# Altium schematic sheet SOIL_MOISTURE_3IN.SchDoc
size A3
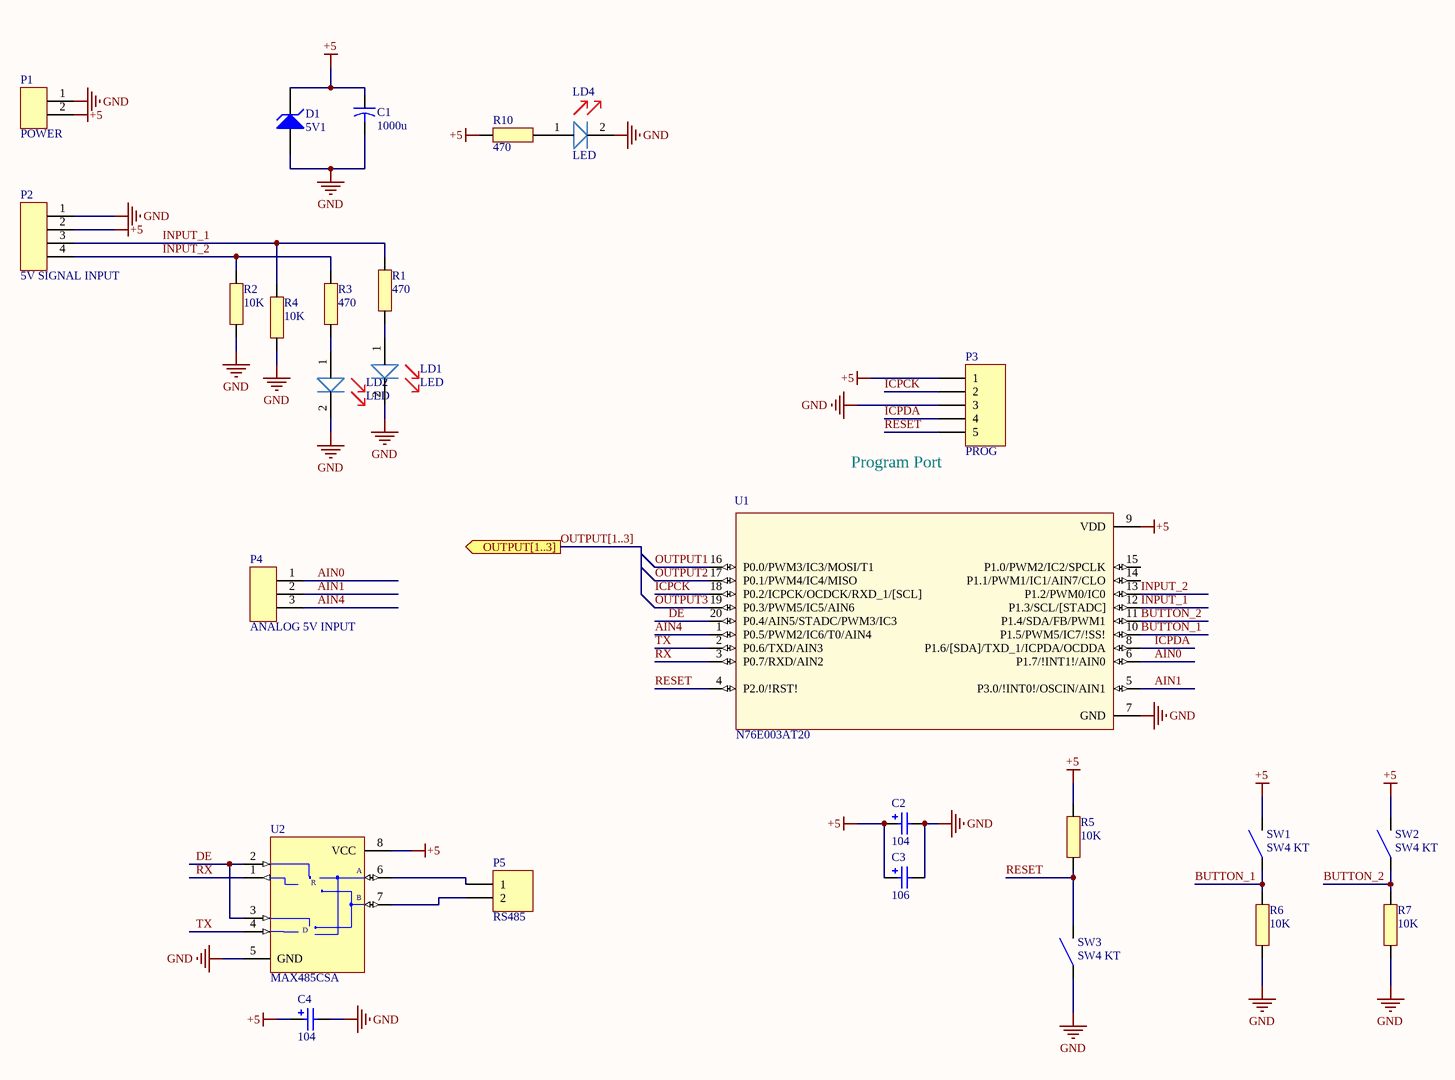
[diagram p0: SOIL_MOISTURE_3IN.SchDoc]

## Parts
C1  1000u  [CAPR5-4X5]
C2  104  [Resistor]
C3  106  [Resistor]
C4  104  [Resistor]
D1  5V1  [DO-41]
LD1  LED  [LED_SMD]
LD2  LED  [LED_SMD]
LD4  LED  [LED_SMD]
P1  POWER  [2 PIN TERMINAL]
P2  5V SIGNAL INPUT  [4 PIN TERMINAL]
P3  PROG  [HDR1X5]
P4  ANALOG 5V INPUT  [3 PIN TERMINAL]
P5  RS485  [HDR1X2]
R1  470  [Resistor]
R2  10K  [Resistor]
R3  470  [Resistor]
R4  10K  [Resistor]
R5  10K  [Resistor]
R6  10K  [Resistor]
R7  10K  [Resistor]
R10  470  [Resistor]
SW1  SW4 KT  [SW4_6x6x8mm]
SW2  SW4 KT  [SW4_6x6x8mm]
SW3  SW4 KT  [SW4_6x6x8mm]
U1  N76E003AT20  [*SOP65P640X120-20N]
U2  MAX485CSA  [NSO8_N]

## Ports
OUTPUT[1..3] (out)

## Nets
+5: C1.1 C2.1 C3.1 C4.1 D1.2(K) P1.2 P2.2 P3.1 R5.2 R10.1 SW1.2 SW2.2 U1.9(VDD) U2.8(VCC)
GND: C1.2 C2.2 C3.2 C4.2 D1.1(A) LD1.2 LD2.2 LD4.2 P1.1 P2.1 P3.3 R2.2 R4.2 R6.1 R7.1 SW3.1 U1.7(GND) U2.5(GND)
AIN0: P4.1 U1.6(P1.7/!INT1!/AIN0)
AIN1: P4.2 U1.5(P3.0/!INT0!/OSCIN/AIN1)
AIN4: P4.3 U1.1(P0.5/PWM2/IC6/T0/AIN4)
BUTTON_1: R6.2 SW1.1 U1.10(P1.5/PWM5/IC7/!SS!)
BUTTON_2: R7.2 SW2.1 U1.11(P1.4/SDA/FB/PWM1)
DE: U1.20(P0.4/AIN5/STADC/PWM3/IC3) U2.2(~{RE}) U2.3(DE)
ICPCK: P3.2 U1.18(P0.2/ICPCK/OCDCK/RXD_1/[SCL])
ICPDA: P3.4 U1.8(P1.6/[SDA]/TXD_1/ICPDA/OCDDA)
INPUT_1: P2.3 R1.1 R4.1 U1.12(P1.3/SCL/[STADC])
INPUT_2: P2.4 R2.1 R3.1 U1.13(P1.2/PWM0/IC0)
OUTPUT1: U1.16(P0.0/PWM3/IC3/MOSI/T1)
OUTPUT2: U1.17(P0.1/PWM4/IC4/MISO)
OUTPUT3: U1.19(P0.3/PWM5/IC5/AIN6)
RESET: P3.5 R5.1 SW3.2 U1.4(P2.0/!RST!)
RX: U1.3(P0.7/RXD/AIN2) U2.1(RO)
TX: U1.2(P0.6/TXD/AIN3) U2.4(DI)
NetLD1_1: LD1.1 R1.2
NetLD2_1: LD2.1 R3.2
NetLD4_1: LD4.1 R10.2
NetP5_1: P5.1 U2.6(A)
NetP5_2: P5.2 U2.7(B)

Not connected (* = marked no-connect by the designer): U1 14(P1.1/PWM1/IC1/AIN7/CLO) 15(P1.0/PWM2/IC2/SPCLK)

## Buses and harness runs
bus OUTPUT[1..3] = port OUTPUT[1..3]

## Notes on the sheet
- (near P3) Program Port
- Title
- Size:
- Date:
- A3
- Number:
- Time:
- Revision:
- Sheet
- of
- File:
- (in symbol MAX485CSA) R; D

## Library data of the parts
C1 = Cap2: Capacitor; Published: 23-Sep-2002; PackageReference: CAPR5-4X5; Publisher: Altium Limited; PackageDescription: Capacitor; 2 Leads
C2-C4 = Cap Pol3: Polarized Capacitor (Surface Mount); Published: 8-Jun-2000; LatestRevisionDate: 29-May-2009; LatestRevisionNote: IPC-7351 Footprint Added.; PackageReference: C0805; Publisher: Altium Limited; PackageDescription: Chip Capacitor
  C2 C4: Value: 104
  C3: Value: 106
D1 = D Zener: Zener Diode; Published: 8-Jun-2000; LatestRevisionDate: 17-Jul-2002; LatestRevisionNote: Re-released for DXP Platform.; PackageReference: DIODE-0.7; Publisher: Altium Limited; PackageDescription: Diode, Thru-Hole; 2 Leads; 0.7 in Pin Spacing
LD1 LD2 LD4 = LED_SMD: 0805; LatestRevisionDate: 17-Jul-2002; LatestRevisionNote: Re-released for DXP Platform.; Publisher: Altium Limited
P1 = 2 PIN TERMINAL: Header, 2-Pin; LatestRevisionDate: 17-Jul-2002; LatestRevisionNote: Re-released for DXP Platform.; Publisher: Altium Limited
P2 = 4 PIN TERMINAL: Header, 4-Pin; LatestRevisionDate: 17-Jul-2002; LatestRevisionNote: Re-released for DXP Platform.; Publisher: Altium Limited
P3 = Header 5: Header, 5-Pin; LatestRevisionDate: 17-Jul-2002; LatestRevisionNote: Re-released for DXP Platform.; Publisher: Altium Limited
P4 = 3 PIN TERMINAL: Header, 2-Pin; LatestRevisionDate: 17-Jul-2002; LatestRevisionNote: Re-released for DXP Platform.; Publisher: Altium Limited
P5 = Header 2: Header, 2-Pin; LatestRevisionDate: 17-Jul-2002; LatestRevisionNote: Re-released for DXP Platform.; Publisher: Altium Limited
R1-R7 R10 = Resistor: LatestRevisionDate: 17-Jul-2002; LatestRevisionNote: Re-released for DXP Platform.; Publisher: Altium Limited
  R1 R3 R10: Value: 470
  R2 R4-R7: Value: 10K
U1 = N76E003AT20: 8051 Mcu, Shape: t; MP: N76E003AT20-T; MF: Nuvoton; Package: None; SnapEDA_Link: https://www.snapeda.com/parts/N76E003AT20-T/Nuvoton/view-part/?ref=snap; Availability: Unavailable; Price: None; Value: *
U2 = MAX485CSA: Low-Power, Slew-Rate-Limited RS-485/RS-422 Transceiver; Published: 16-Jan-2001; LatestRevisionDate: 13-Apr-2006; LatestRevisionNote: IPC-7351 Footprint Added.; DatasheetVersion: Feb-1996; PackageReference: NSO8; Publisher: Altium Limited; PackageDescription: 8-Pin Small Outline Integrated Circuit 1.27 mm Pitch; Code_JEDEC: MS-012-AA; Code_IPC: SOIC127P600-8; ComponentLink1Description: Manufacturer Link; ComponentLink1URL: http://www.maxim-ic.com/; ComponentLink2Description: Datasheet; ComponentLink2URL: http://pdfserv.maxim-ic.com/en/ds/MAX1487-MAX491.pdf